# EAGLE design rare (EAGLE 9.6.2)
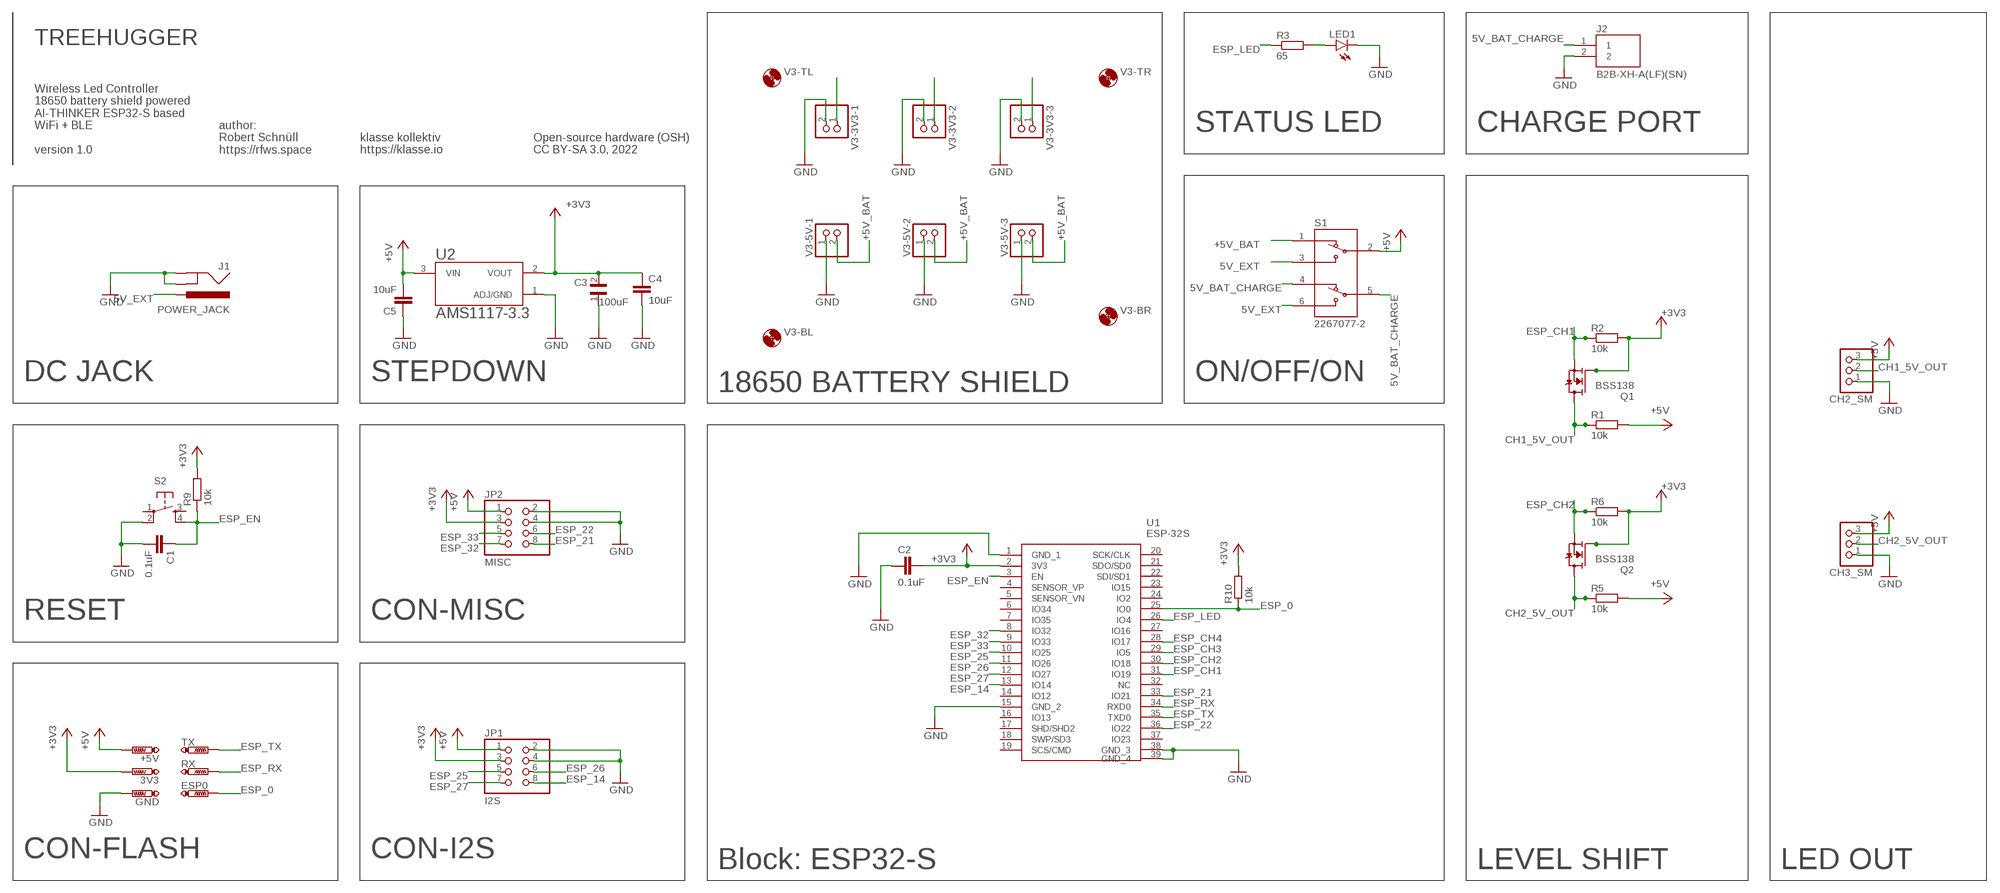
[diagram p0: schematic, sheet 1]

## Parts
3V3  PTR1TP15R  [TP15R]
+5V  PTR1TP15R  [TP15R]
C1  0.1uF  C-EUC0805  [C0805]
C2  0.1uF  C-EUC0805  [C0805]
C3  100uF  TAJB107K006RNJ  [CAPPC3528X210N]
C4  10uF  C-EUC0805  [C0805]
C5  10uF  C-EUC0805  [C0805]
CH2_SM  PINHD-1X3/90  [1X03/90]
CH3_SM  PINHD-1X3/90  [1X03/90]
ESP0  PTR1TP15R  [TP15R]
GND  PTR1TP15R  [TP15R]
J1  POWER_JACK  [POWER_JACK_PTH]
J2  B2B-XH-A(LF)(SN)  [JST_B2B-XH-A(LF)(SN)]
JP1  I2S  PINHD-2X4  [2X04]
JP2  MISC  PINHD-2X4  [2X04]
LED1  LEDCHIP-LED0805  [CHIP-LED0805]
Q1  BSS138  [SOT23]
Q2  BSS138  [SOT23]
R1  10k  R-EU_R0805  [R0805]
R2  10k  R-EU_R0805  [R0805]
R3  65  R-EU_R0805  [R0805]
R5  10k  R-EU_R0805  [R0805]
R6  10k  R-EU_R0805  [R0805]
R9  10k  R-EU_R0805  [R0805]
R10  10k  R-EU_R0805  [R0805]
RX  PTR1TP15R  [TP15R]
S1  2267077-2  [TE_2267077-2]
S2  TAC_SWITCHSMD  [TACTILE_SWITCH_SMD]
TX  PTR1TP15R  [TP15R]
U1  ESP-32S  [ESP-32S]
U2  AMS1117-3.3  [SOT229P700X180-4N]
V3-3V3-1  PINHD-1X2  [1X02]
V3-3V3-2  PINHD-1X2  [1X02]
V3-3V3-3  PINHD-1X2  [1X02]
V3-5V-1  PINHD-1X2  [1X02]
V3-5V-2  PINHD-1X2  [1X02]
V3-5V-3  PINHD-1X2  [1X02]
V3-BL  MOUNT-HOLE3.2  [3,2]
V3-BR  MOUNT-HOLE3.2  [3,2]
V3-TL  MOUNT-HOLE3.2  [3,2]
V3-TR  MOUNT-HOLE3.2  [3,2]

## Nets
5V_BAT_CHARGE: J2.1 S1.4 S1.5
5V_EXT: J1.PWR S1.3 S1.6
+3V3: 3V3.TP C2.2 C3.2 C4.1 JP1.3 JP2.3 Q1.1(G) Q2.1(G) R2.2 R6.2 R9.2 R10.2 U1.2(3V3) U2.2(VOUT)
+5V: +5V.TP C5.2 CH2_SM.3 CH3_SM.3 JP1.1 JP2.1 R1.2 R5.2 S1.2 U2.3(VIN)
+5V_BAT: S1.1 V3-5V-1.2 V3-5V-2.2 V3-5V-3.2
CH1_5V_OUT: CH2_SM.2 Q1.3(D) R1.1
CH2_5V_OUT: CH3_SM.2 Q2.3(D) R5.1
ESP_0: ESP0.TP R10.1 U1.25(IO0)
ESP_14: JP1.8 U1.13(IO14)
ESP_21: JP2.8 U1.33(IO21)
ESP_22: JP2.6 U1.36(IO22)
ESP_25: JP1.5 U1.10(IO25)
ESP_26: JP1.6 U1.11(IO26)
ESP_27: JP1.7 U1.12(IO27)
ESP_32: JP2.7 U1.8(IO32)
ESP_33: JP2.5 U1.9(IO33)
ESP_CH1: Q1.2(S) R2.1 U1.31(IO19)
ESP_CH2: Q2.2(S) R6.1 U1.30(IO18)
ESP_CH3: U1.29(IO5)
ESP_CH4: U1.28(IO17)
ESP_EN: C1.1 R9.1 S2.4 U1.3(EN)
ESP_LED: R3.1 U1.26(IO4)
ESP_RX: RX.TP U1.34(RXD0)
ESP_TX: TX.TP U1.35(TXD0)
GND: C1.2 C2.1 C3.1 C4.2 C5.1 CH2_SM.1 CH3_SM.1 GND.TP J1.GND J1.GNDBREAK J2.2 JP1.2 JP1.4 JP2.2 JP2.4 LED1.C S2.2 U1.1(GND_1) U1.15(GND_2) U1.38(GND_3) U1.39(GND_4) U2.1(ADJ/GND) V3-3V3-1.2 V3-3V3-2.2 V3-3V3-3.2 V3-5V-1.1 V3-5V-2.1 V3-5V-3.1
N$1: LED1.A R3.2
N$2: V3-3V3-1.1
N$4: V3-3V3-2.1
N$5: V3-3V3-3.1
Unconnected: S2.1 S2.3 U1.4(SENSOR_VP) U1.5(SENSOR_VN) U1.6(IO34) U1.7(IO35) U1.14(IO12) U1.16(IO13) U1.17(SHD/SHD2) U1.18(SWP/SD3) U1.19(SCS/CMD) U1.20(SCK/CLK) U1.21(SDO/SD0) U1.22(SDI/SD1) U1.23(IO15) U1.24(IO2) U1.27(IO16) U1.32(NC) U1.37(IO23)

## Notes on the sheet
- TREEHUGGER
- STATUS LED | CHARGE PORT
- Wireless Led Controller
  18650 battery shield powered
  AI-THINKER ESP32-S based
  WiFi + BLE
  
  version 1.0
- author:
  Robert Schnüll
  https://rfws.space
- klasse kollektiv
  https://klasse.io
- Open-source hardware (OSH)
  CC BY-SA 3.0, 2022
- DC JACK | STEPDOWN | ON/OFF/ON
- 18650 BATTERY SHIELD
- RESET | CON-MISC
- CON-FLASH | CON-I2S
- Block: ESP32-S | LEVEL SHIFT | LED OUT

## Library data of the parts
3V3 +5V ESP0 GND RX TX = testpad:PTR1: TEST PIN
C1 C2 C4 C5 = rcl:C-EU: CAPACITOR, European symbol; SPICEPREFIX: C
C3 = TAJB107K006RNJ:TAJB107K006RNJ: SMTT 100M B 006V K 125 Check availability <https://pricing.snapeda.com/parts/TAJB107K006RNJ/AVX/view-part?ref=eda>; AVAILABILITY: In Stock; DESCRIPTION: 100 µF Molded Tantalum Capacitors 6.3 V 1411 (3528 Metric), 1210 1.7Ohm; MF: AVX; MP: TAJB107K006RNJ; PACKAGE: 1210 AVX; PRICE: None; PURCHASE-URL: https://pricing.snapeda.com/search/part/TAJB107K006RNJ/?ref=eda
CH2_SM CH3_SM = pinhead:PINHD-1X3: PIN HEADER
J1 = SparkFun-Connectors:POWER_JACK: Power Jack Connector This is the standard 5.5mm barrel jack for power. The PTH is the most common, proven, reliable, footprint. The Slot footprint only works if the mill layer is transmitted to the PCB fab house so be warned. Here are the connectors we sell at SparkFun: DC Barrel Power Jack/Connector <https://www.sparkfun.com/products/119> (PRT-00119) DC Barrel Power Jack/Connector (SMD) <https://www.sparkfun.com/products/12748> (PRT-12748) DC Barrel Jack Adapter - Breadboard Compatible <https://www.sparkfun.com/products/10811> (PRT-10811) It is used on this SparkFun product (and many, many others): SparkFun RedBoard - Programmed with Arduino <https://www.sparkfun.com/products/12757> (DEV-12757) Also, if you need a mating power supply or connector, please check these out: Wall Adapter Power Supply - 9VDC 650mA <https://www.sparkfun.com/products/298> (TOL-00298) DC Barrel Jack Adapter - Male <https://www.sparkfun.com/products/10287> (PRT-10287); PROD_ID: CONN-08197
J2 = B2B-XH-A_LF__SN_:B2B-XH-A(LF)(SN): Connector Header Through Hole 2 position 0.098" (2.50mm) Check prices <https://pricing.snapeda.com/parts/B2B-XH-A%28LF%29%28SN%29/JST%20Sales/view-part?ref=eda> Check availability <https://pricing.snapeda.com/parts/B2B-XH-A%28LF%29%28SN%29/JST%20Sales%20America%20Inc./view-part?ref=eda>; AVAILABILITY: In Stock; DESCRIPTION: Connector Header Through Hole 2 position 0.098 (2.50mm); MF: JST Sales America Inc.; MP: B2B-XH-A(LF)(SN); PACKAGE: None; PRICE: None; PURCHASE-URL: https://pricing.snapeda.com/search/part/B2B-XH-A(LF)(SN)/?ref=eda
JP1 JP2 = pinhead:PINHD-2X4: PIN HEADER
LED1 = led:LED: LED OSRAM: - CHIPLED LG R971, LG N971, LY N971, LG Q971, LY Q971, LO R971, LY R971 LH N974, LH R974 LS Q976, LO Q976, LY Q976 LO Q996 - Hyper CHIPLED LW Q18S LB Q993, LB Q99A, LB R99A - SideLED LS A670, LO A670, LY A670, LG A670, LP A670 LB A673, LV A673, LT A673, LW A673 LH A674 LY A675 LS A676, LA A676, LO A676, LY A676, LW A676 LS A679, LY A679, LG A679 - Hyper Micro SIDELED® LS Y876, LA Y876, LO Y876, LY Y876 LT Y87S - SmartLED LW L88C, LW L88S LB L89C, LB L89S, LG L890 LS L89K, LO L89K, LY L89K LS L896, LA L896, LO L896, LY L896 - TOPLED LS T670, LO T670, LY T670, LG T670, LP T670 LSG T670, LSP T670, LSY T670, LOP T670, LYG T670 LG T671, LOG T671, LSG T671 LB T673, LV T673, LT T673, LW T673 LH T674 LS T676, LA T676, LO T676, LY T676, LB T676, LH T676, LSB T676, LW T676 LB T67C, LV T67C, LT T67C, LS T67K, LO T67K, LY T67K, LW E67C LS E67B, LA E67B, LO E67B, LY E67B, LB E67C, LV E67C, LT E67C LW T67C LS T679, LY T679, LG T679 LS T770, LO T770, LY T770, LG T770, LP T770 LB T773, LV T773, LT T773, LW T773 LH T774 LS E675, LA E675, LY E675, LS T675 LS T776, LA T776, LO T776, LY T776, LB T776 LHGB T686 LT T68C, LB T68C - Hyper Mini TOPLED® LB M676 - Mini TOPLED Santana® LG M470 LS M47K, LO M47K, LY M47K Source: http://www.osram.convergy.de LUXEON: - LUMILED® LXK2-PW12-R00, LXK2-PW12-S00, LXK2-PW14-U00, LXK2-PW14-V00 LXK2-PM12-R00, LXK2-PM12-S00, LXK2-PM14-U00 LXK2-PE12-Q00, LXK2-PE12-R00, LXK2-PE12-S00, LXK2-PE14-T00, LXK2-PE14-U00 LXK2-PB12-K00, LXK2-PB12-L00, LXK2-PB12-M00, LXK2-PB14-N00, LXK2-PB14-P00, LXK2-PB14-Q00 LXK2-PR12-L00, LXK2-PR12-M00, LXK2-PR14-Q00, LXK2-PR14-R00 LXK2-PD12-Q00, LXK2-PD12-R00, LXK2-PD12-S00 LXK2-PH12-R00, LXK2-PH12-S00 LXK2-PL12-P00, LXK2-PL12-Q00, LXK2-PL12-R00 Source: www.luxeon.com KINGBRIGHT: KA-3528ASYC Source: www.kingbright.com
Q1 Q2 = bss138_10:BSS138: BSS138 N-Channel Logic Level Enhancement Mode Field Effect Transistor Source: http://www.fairchildsemi.com/datasheets/BS/BSS138.pdf; MF: Fairchild; MPN: BSS138; OC_FARNELL: 9845330; OC_NEWARK: 67R2009
R1 R2 R5 R6 = resistor:R-EU_: RESISTOR, European symbol
R3 R9 R10 = rcl:R-EU_: RESISTOR, European symbol; SPICEPREFIX: R
S1 = 2267077-2:2267077-2: Switch Toggle ON ON DPDT Long Baton Lever PC Pins 20VAC 20VDC 0.4VA PC Mount with Threads Buy Part <https://snapeda.com/parts/2267077-2/TE%20Connectivity/view-part/?ref=eda>; AVAILABILITY: Bad; COMMENT: 2267077-2; DESCRIPTION: Switch Toggle ON ON DPDT Long Baton Lever PC Pins 20VAC 20VDC 0.4VA PC Mount with Threads; EU_ROHS_COMPLIANCE: Compliant with Exemptions; MF: TE Connectivity; MP: 2267077-2; PACKAGE: TO-94 TE Connectivity; PRICE: None
S2 = SparkFun:TAC_SWITCH: Momentary Switch Button commonly used for reset or general input. Spark Fun Electronics SKU : COM-00097
U1 = ESP-32s:ESP-32S: WiFi-BT-BLE MCU module Source: Datasheet; DESCRIPTION: WiFi-BT-BLE MCU module; HEIGHT: mm; MANUFACTURER_NAME: Ai-Thinker; MANUFACTURER_PART_NUMBER: ESP-32s
U2 = AMS1117-3.3:AMS1117-3.3: Sot223/Pkg 1-Amp 3.3-Volt Low Drop Out Voltage Regulatator; AVAILABILITY: Unavailable; DESCRIPTION: Sot223/Pkg 1-Amp 3.3-Volt Low Drop Out Voltage Regulatator; MF: Advanced Monolithic Systems; MP: AMS1117-3.3; PACKAGE: None; PRICE: None
V3-3V3-1-V3-3V3-3 V3-5V-1-V3-5V-3 = pinhead:PINHD-1X2: PIN HEADER
V3-BL V3-BR V3-TL V3-TR = _holes:MOUNT-HOLE: MOUNTING HOLE with drill center marker

## Board
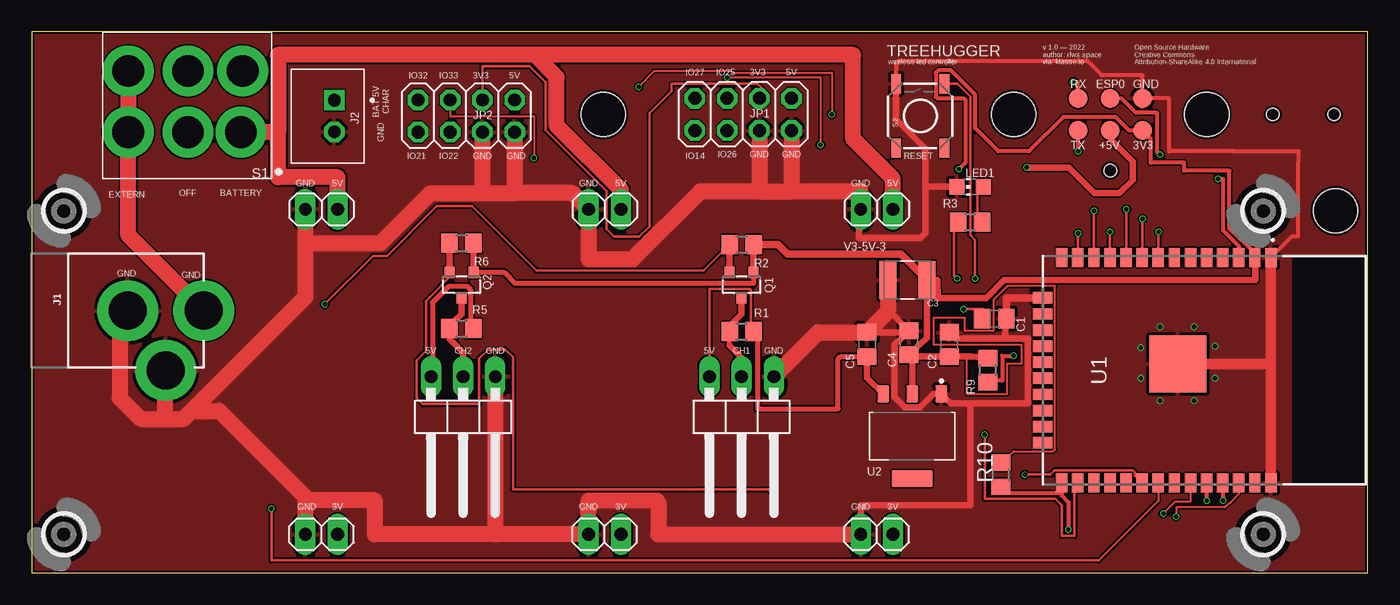
[diagram p1: board, top side]
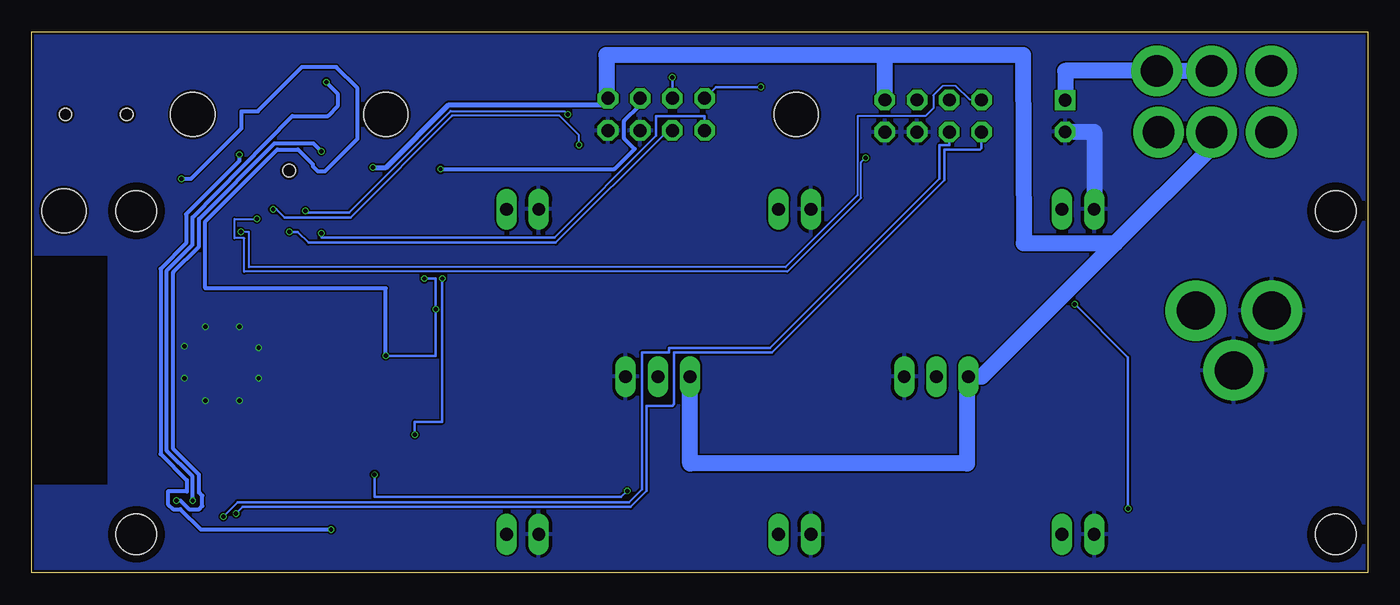
[diagram p2: board, bottom side, seen from below]

Size 105.41 x 42.72 mm. Coordinates in mm from the lower left corner, seen from the top.
Outline: 0,0 105.41,0 105.41,42.72 0,42.72 0,0
Copper layers (1*16): Top 0.035mm / dielectric 1.6mm / Bottom 0.035mm
Design rules "jlcpcb-2layers *": minimum track width 5mil, minimum drill 0.3mm, track to track 5mil, track to pad 5mil, pad to pad 5mil, via to via 5mil, smd to smd 5mil, copper to edge 0.2mm, drill to drill 6mil, minimum pad ring 10mil, minimum via ring 3mil, stop-mask expansion 4mil, vias tented up to drill 0mil, thermal gap 10mil
Holes 1 mm at 85.09,31.75 97.92,36.2 102.74,36.2
Holes 3.5 mm at 77.47,36.2 92.71,36.2 102.87,28.57 45.09,36.2
tRestrict: area 99.4,7 to 105.4,25
bRestrict: area 99.4,7 to 105.4,25
vRestrict: area 99.4,7 to 105.4,25

### Footprints (pad centres in the part's own frame; a part is rotated, then mirrored left to right if it is on the bottom)
TP15R = smd 1.5 x 1.5: TP 0,0
C0805 = smd 1.3 x 1.5: 1 -0.95,0; 2 0.95,0
CAPPC3528X210N = smd 1.34 x 3.02: 1 -1.54,0; 2 1.54,0
1X03/90 = drill 1.016 long: 1 -2.54,-3.81; 2 0,-3.81; 3 2.54,-3.81
POWER_JACK_PTH = drill 2.997 pad 4.318: GND 0,7.7; GNDBREAK 4.7,10.7; PWR 0,13.7
JST_B2B-XH-A(LF)(SN) = drill 1 square: 1 1.25,0 | drill 1 octagon: 2 -1.25,0
2X04 = drill 1.016 octagon: 1 -3.81,-1.27; 2 -3.81,1.27; 3 -1.27,-1.27; 4 -1.27,1.27; 5 1.27,-1.27; 6 1.27,1.27; 7 3.81,-1.27; 8 3.81,1.27
CHIP-LED0805 = smd 1.2 x 1.2: A 0,-1.05; C 0,1.05
SOT23 = smd 0.8 x 0.9: 1 -0.95,-1; 2 0.95,-1; 3 0,1
R0805 = smd 1.3 x 1.5: 1 -0.95,0; 2 0.95,0
TE_2267077-2 = drill 2.5: 1 -2.032,3.302; 2 2.159,3.302; 3 6.858,3.302; 4 -2.159,-1.524; 5 2.159,-1.524; 6 6.858,-1.524
TACTILE_SWITCH_SMD = smd 1.524 x 0.762: 1 -2.54,1.905; 2 2.54,1.905; 3 -2.54,-1.905; 4 2.54,-1.905
ESP-32S = smd 1.5 x 0.9: 1 -8.9,18.01; 2 -8.9,16.74; 3 -8.9,15.47; 4 -8.9,14.2; 5 -8.9,12.93; 6 -8.9,11.66; 7 -8.9,10.39; 8 -8.9,9.12; 9 -8.9,7.85; 10 -8.9,6.58; 11 -8.9,5.31; 12 -8.9,4.04; 13 -8.9,2.77; 14 -8.9,1.5; 25 8.9,1.5; 26 8.9,2.77; 27 8.9,4.04; 28 8.9,5.31; 29 8.9,6.58; 30 8.9,7.85; 31 8.9,9.12; 32 8.9,10.39; 33 8.9,11.66; 34 8.9,12.93; 35 8.9,14.2; 36 8.9,15.47; 37 8.9,16.74; 38 8.9,18.01 | smd 0.9 x 1.5: 15 -5.71,0; 16 -4.44,0; 17 -3.17,0; 18 -1.9,0; 19 -0.63,0; 20 0.64,0; 21 1.91,0; 22 3.18,0; 23 4.45,0; 24 5.72,0 | smd 4.5 x 4.5: 39 -0.508,10.668
SOT229P700X180-4N = smd 0.93 x 1.31: 1 -2.29,-3.345; 2 0,-3.345; 3 2.29,-3.345 | smd 3.24 x 1.31: 4 0,3.345
1X02 = drill 1.016 long: 1 -1.27,0; 2 1.27,0
3,2 = hole 3.2: 0,0

### Placement (x,y rotation side)
3V3  87.63,34.92 0 top
+5V  85.09,34.92 0 top
C1  75.95,20.07 0 top
C2  72.39,18.03 270 top
C3  69.09,23.11 0 top
C4  69.22,18.16 90 top
C5  65.91,18.03 270 top
CH2_SM  56.01,11.68 180 top
CH3_SM  34.04,11.68 180 top
ESP0  85.09,37.47 0 top
GND  87.63,37.47 0 top
J1  -0.13,20.7 270 top
J2  23.88,36.07 90 top
JP1  56.13,36.2 180 top
JP2  34.29,36.07 180 top
LED1  74.04,30.48 90 top
Q1  56.01,22.73 180 top
Q2  33.91,22.73 180 top
R1  56.01,19.05 0 top
R2  56.01,25.91 0 top
R3  74.04,27.69 0 top
R5  33.91,19.3 0 top
R6  33.91,26.04 0 top
R9  75.44,16 90 top
R10  76.45,7.75 90 top
RX  82.55,37.47 0 top
S1  14.48,38.1 180 top
S2  70.1,36.07 90 top
TX  82.55,34.92 0 top
U1  79.76,16 270 top
U2  69.47,10.79 180 top
V3-3V3-1  22.86,3.05 180 top
V3-3V3-2  45.21,3.05 180 top
V3-3V3-3  66.67,3.05 180 top
V3-5V-1  22.86,28.7 0 top
V3-5V-2  45.21,28.7 0 top
V3-5V-3  66.67,28.7 0 top
V3-BL  2.54,3.05 0 top
V3-BR  97.16,3.05 0 top
V3-TL  2.54,28.57 0 top
V3-TR  97.16,28.57 0 top

### Tracks (layer width: path | path; a pad name or v marks a point on that pad's centre or on a via)
5V_BAT_CHARGE
  Bottom 1.27: J2.1 23.88,39.62 S1.4 S1.5
5V_EXT
  Top 1.27: J1.PWR 7.62,26.65 S1.3 S1.6
+3V3  (via drill 0.35)
  Top 0.152: R10.2 77.48,9.6 80.6,9.6 80.73,9.74 80.73,22.64 76.98,22.64 75.89,21.55 75.89,19.11 75.87,19.08 73.63,19.08 73.63,20.12 71.16,20.12 71.16,18.03 78.08,18.03 78.08,16.53 78.06,16.51 76.96,16.51 76.96,14.12 73.79,14.12 73.79,17.08
  Top 0.2: JP2.3 35.56,40 39.28,40 40.54,38.75 40.54,34.95 45.34,30.14 45.34,27.14 45.94,26.55 47.92,26.55 48.72,27.35 48.72,36.28 50.49,38.05 50.49,38.61 57.28,38.61 57.53,38.35 57.53,37.59 JP1.3
  Top 0.305: v73.15,31.88 73.66,32.38 73.66,37.34 73.53,37.47 71.47,37.47 71.32,37.59 71.32,39.5 71.5,39.67 72.52,39.67 74.45,37.74 74.45,35.09 76.26,33.28 78.68,33.28 81.38,35.98 85.53,35.98 86.58,34.92 3V3.TP 88.27,34.29 88.27,32.38 90.93,32.38 90.93,31.75 94.49,31.75 94.49,27.18 96.5,25.3 U1.2
  Top 0.406: Q2.1 37.26,23.73 38.13,22.86 56.96,22.86 Q1.1
  Top 0.508: Q2.1 R6.2 | Q1.1 R2.2 | C4.1 69.47,16.96 U2.2 | C4.1 69.34,17.08 C2.2 73.79,17.08 74.15,17.08 R9.2 | C4.1 70.06,18.05 70.13,18.05 70.63,18.55 C3.2 71.47,23.11 71.51,21.72 75.31,21.72 76.71,23.11 96.52,23.11 96.52,24.88 U1.2
  Top 0.61: R2.2 58.88,25.91 59.62,25.17 68.57,25.17 C3.2
  Bottom 0.305: v73.15,31.88 59.44,31.88 57.85,33.47 58.67,34.29 58.66,35.68 57.4,36.94 JP1.3
+5V  (via drill 0.35)
  Top 0.203: 56.76,19.24 56.76,22.33 56.68,22.41 53.47,22.41 CH2_SM.3
  Top 0.406: R5.2 34.66,19.5 34.66,22.33 34.39,22.61 32.89,22.61 31.62,21.34 31.62,15.62 CH3_SM.3 | 56.76,19.24 R1.2 57.28,18.73 57.28,12.95 63.63,12.95 63.63,16.89 63.82,17.08 C5.2
  Top 0.508: U2.3 65.91,15.41 C5.2 | v78.49,32 81.82,32 83.84,29.98 85.82,29.98 86.86,31.02 86.86,32.48 85.22,34.13 85.22,34.8 +5V.TP
  Bottom 0.406: JP1.1 60.45,36.96 72.51,36.96 77.46,32 v78.49,32
  Bottom 1.27: 19.91,26.04 30.45,15.49 CH3_SM.3 31.62,15.37 31.62,8.64 53.47,8.64 CH2_SM.3 | JP2.1 38.1,40.87 | 19.91,26.04 27.14,26.04 27.2,40.87 38.1,40.87 | 38.1,40.87 60.07,40.87 60.07,37.59 JP1.1 | S1.2 12.32,33.62 19.91,26.04
+5V_BAT
  Top 1.27: V3-5V-1.2 24.13,31.24 19.44,31.24 19.44,34.8 | V3-5V-2.2 46.48,30.26 41.43,35.31 41.43,39.12 39.66,40.89 | 39.66,40.89 19.44,40.89 19.44,34.8 | 19.44,34.8 S1.1 | V3-5V-3.2 67.94,31.11 64.8,34.27 64.8,40.89 39.66,40.89
CH1_5V_OUT
  Top 0.406: 55.06,17.97 R1.1
  Top 0.508: R1.1 55.06,19.5 56.01,20.45 Q1.3 | CH2_SM.2 56.01,17.02 55.06,17.97
CH2_5V_OUT
  Top 0.406: 32.96,18.48 R5.1
  Top 0.508: R5.1 33.34,19.68 33.34,19.88 33.91,20.45 Q2.3 | CH3_SM.2 34.04,17.4 32.96,18.48
ESP_0  (via drill 0.35)
  Top 0.305: ESP0.TP 85.98,37.47 87.12,36.32 88.77,36.32 88.77,33.27 v89.03,33.02 | v81.79,3.43 81.79,5.59 81.26,6.12 U1.25 81.26,6.29 76.45,6.29 R10.1
  Bottom 0.305: v81.79,3.43 92.08,3.43 93.68,5.03 94.26,5.03 94.66,5.43 94.66,6.43 93.17,6.43 93.17,7.32 95.25,9.4 95.25,24 93.22,26.03 93.22,28.32 89.03,32.51 v89.03,33.02
ESP_14  (via drill 0.35)
  Top 0.2: U1.13 82.53,26.77 v82.55,26.8
  Bottom 0.2: v82.55,26.8 82.55,26.47 64.17,26.47 56.14,34.51 56.14,36.07 52.32,36.07 JP1.8
ESP_21  (via drill 0.35)
  Top 0.152: U1.33 91.42,5.62 90.2,5.62 v89.28,4.7
  Bottom 0.2: v89.28,4.7 88.77,5.21 58.17,5.21 56.9,6.47 56.9,13.2 54.87,13.2 54.74,13.34 54.73,14.82 54.73,17.4 46.99,17.4 33.4,30.99 33.4,33.4 30.61,33.4 30.48,33.53 JP2.8
ESP_22  (via drill 0.35)
  Top 0.152: U1.36 95.23,6.23 94.58,5.59 94.14,5.17 90.3,5.17 v90.3,4.45
  Bottom 0.2: JP2.6 33.02,33.78 33.78,33.78 33.78,31.11 47.15,17.75 55.12,17.75 55.12,17.4 57.27,17.4 57.27,6.61 58.3,5.58 89.16,5.58 v90.3,4.45
ESP_25  (via drill 0.35)
  Top 0.152: v54.86,39.12 62.23,39.12 v62.23,33.78
  Top 0.2: v86.36,28.7 86.36,24.93 U1.10
  Bottom 0.152: v62.23,33.78 62.23,34.54 63.82,36.13 72.26,36.13 72.22,36.1
  Bottom 0.2: JP1.5 v54.86,39.12 | 72.22,36.1 80.26,28.07 85.47,28.07 86.11,28.7 v86.36,28.7
ESP_26  (via drill 0.35)
  Top 0.2: U1.11 85.07,26.9 v85.09,26.92
  Bottom 0.2: JP1.6 55.22,34.92 64.08,26.06 83.58,26.06 84.44,26.92 v85.09,26.92
ESP_27  (via drill 0.35)
  Top 0.152: v47.88,38.35 49.15,39.62 55.12,39.62 55.24,39.5 63.12,39.5 v63.12,36.2
  Top 0.2: U1.12 83.8,28.55 v83.82,28.57
  Bottom 0.152: 72.37,36.45 63.37,36.45 v63.12,36.2
  Bottom 0.2: JP1.7 51.44,38.35 v47.88,38.35 | 72.37,36.45 80.37,28.45 83.7,28.45 v83.82,28.57
ESP_32  (via drill 0.35)
  Top 0.2: v88.9,26.92 88.9,24.93 U1.8
  Bottom 0.127: 34.29,37.7 33.5,38.48 32.54,38.48 31.39,37.34 JP2.7
  Bottom 0.152: 34.29,37.7 34.29,36.67 34.89,36.07 40.26,36.07 40.26,29.81 45.94,24.13 88.27,24.13 88.27,26.92 v88.9,26.92
ESP_33  (via drill 0.35)
  Top 0.152: JP2.5 33.02,36.07 39.62,36.07 v39.62,32.77
  Top 0.2: U1.9 87.61,27.92 v87.63,27.94
  Bottom 0.152: 88.64,23.78 45.79,23.78 39.98,29.59 39.98,32.41 v39.62,32.77 | 88.65,23.77 88.65,26.42 89.41,26.42 89.4,27.94 v87.63,27.94
  Bottom 0.2: 88.64,23.78 88.65,23.77 | v87.63,27.94
ESP_CH1  (via drill 0.35)
  Top 0.152: U1.31 88.88,5.69
  Top 0.2: 88.88,5.69 84.17,0.99 18.92,0.99 v18.92,5.08 | R2.1 53,23.85 39.81,23.85 34.73,28.94 31.95,28.94
  Top 0.203: 31.95,28.94 28.03,25.02 26.92,25.02 v23.11,21.21
  Top 0.508: Q1.2 R2.1
  Bottom 0.2: v23.11,21.21 18.92,17.02 v18.92,5.08
ESP_CH2  (via drill 0.35)
  Top 0.2: U1.30 87.04,7.67 87.04,7.96 86.89,8.1 80.7,8.1 80.37,7.78
  Top 0.203: v58.42,6.48 58.29,6.6 37.96,6.6 37.96,17.03 37.34,17.65 36.03,17.65 35.31,16.93 35.31,13.34 30.82,13.34 30.35,13.8 30.35,16.76 31.11,17.53 31.11,21.46 31.43,21.78 32.96,23.34 Q2.2 | v78.36,7.75 78.39,7.78 80.37,7.78
  Top 0.508: Q2.2 R6.1
  Bottom 0.203: v78.36,7.75 78.36,6 58.9,6 v58.42,6.48
ESP_EN  (via drill 0.35)
  Top 0.2: v73.53,20.83 75.07,20.83 C1.1 | S2.4 73.03,38.61 74.04,37.59 74.04,26.67 74.42,26.29 v74.42,23.24
  Top 0.305: R9.1 75.56,15.18 76.58,15.18 76.58,17.14 v77.47,17.14 | v93.6,31.11 93.98,31.11 93.98,27.05 95.23,25.8 U1.3
  Bottom 0.2: v74.42,23.24 73.53,23.24 v73.53,20.83 73.53,17.14 v77.47,17.14
  Bottom 0.305: v93.6,31.11 92.84,31.11 88.86,35.09 88.86,36.45 87.58,36.45 84.1,39.93 81.38,39.93 79.71,38.26 79.71,34.26 82.27,31.7 82.83,31.7 83.23,32.1 83.23,32.25 84.4,33.42 86.03,33.42 91.71,27.74 91.71,22.48 77.47,22.48 v77.47,17.14
ESP_LED  (via drill 0.35)
  Top 0.2: U1.26 82.27,6.85 82.27,2.92 81.28,2.92 81.28,5.33 81.15,5.46 80.77,5.84 75.18,5.84 v75.18,10.92 | R3.1 72.77,27.37 72.77,23.5 v73.03,23.24
  Bottom 0.2: v75.18,10.92 75.18,11.94 73.03,11.94 v73.03,23.24
ESP_RX  (via drill 0.35)
  Top 0.305: U1.34 92.69,5.74 v92.71,5.71 | v82.17,38.73 82.55,38.73 RX.TP
  Bottom 0.305: v92.71,5.71 92.71,7.62 94.74,9.65 94.74,23.88 92.71,25.91 92.71,28.07 84.85,36.07 82.04,36.07 81.28,36.83 81.28,37.85 v82.17,38.73
ESP_TX  (via drill 0.35)
  Top 0.305: U1.35 93.96,5.74 v93.98,5.71 | TX.TP v82.55,33.27
  Bottom 0.305: v93.98,5.71 93.68,5.71 92.99,5.03 92.21,5.03 91.95,5.29 91.95,6.1 92.2,6.35 92.2,7.75 94.23,9.78 94.23,23.75 92.2,25.78 92.21,27.95 86.24,33.92 83.19,33.92 v82.55,33.27
GND  (via drill 0.35)
  Top 0.305: U1.1 99.42,26.55 99.92,26.55 99.92,31.65 99.98,33.27 94.87,33.27 94.87,33.28 89.74,33.28 89.74,37.47 GND.TP 87.63,39.28 84.42,39.28 83.31,40.39 68.33,40.39 68.2,40.26 S2.2
  Top 0.508: C4.2 68.37,18.27 68.3,18.27 68.06,18.03 68.06,13.9 68.88,13.08 70.06,13.08 71.12,14.14 U2.1 72.5,13.39 74.04,13.39 | C4.2 69.09,18.98 C5.1 | C4.2 67.55,20.78 C3.1 | 74.04,13.39 78.59,13.39 78.59,18.51 77.06,18.51 | 77.06,18.51 76.79,18.78 C1.2 | 77.06,18.51 72.86,18.51 C2.1 | 74.04,13.39 74.04,5.33 65.41,5.33 V3-3V3-3.2 | LED1.C 70.51,30.48 | 70.51,30.48 70.51,26.82 70.1,26.42 65.28,26.42 65.28,28.57 V3-5V-3.1 | 70.51,30.48 70.51,33.5 68.2,35.81 S2.2
  Top 0.61: U1.15 76.9,21.71 C1.2
  Top 0.813: U1.1 97.77,16.51 | 97.77,16.51 U1.38 | U1.39 97.77,16.51
  Top 1.27: CH3_SM.1 36.58,3.05 | 10.54,12.17 8.59,12.17 6.94,13.82 6.94,20.07 J1.GND | 10.54,12.17 12,12.17 12.63,12.8 | 12.63,12.8 14.79,12.8 21.59,6 21.59,5.33 | 36.58,3.05 V3-3V3-2.2 43.94,5.71 49.28,5.71 49.44,5.56 49.44,3.05 V3-3V3-3.2 | 36.58,3.05 27.08,3.05 27.08,5.71 21.97,5.71 21.59,5.33 | 21.59,5.33 V3-3V3-1.2 | V3-5V-1.1 21.59,26.04 | 21.59,26.04 27.52,26.04 31.46,29.97 35.56,29.97 | V3-5V-3.1 65.41,30.11 59.94,30.11 | 57.4,30.11 52.75,30.11 47.4,24.77 43.94,24.77 V3-5V-2.1 42.67,29.97 38.1,29.97 | JP1.2 59.94,30.11 | JP1.4 57.4,30.11 | CH2_SM.1 62.04,18.98 C5.1 67.55,20.62 C3.1 | 57.4,30.11 59.94,30.11 | 35.56,29.97 JP2.4 | 35.56,29.97 38.1,29.97 | JP2.2 38.1,29.97 | 21.59,26.04 21.59,21.76 12.63,12.8 | 10.54,12.17 10.54,15.97 J1.GNDBREAK
  Bottom 1.27: J2.2 21.59,34.82 V3-5V-1.1
  other vias: 91.69,19.43 89.03,19.43 89.03,13.59 91.69,13.59 87.5,17.78 87.5,15.37 93.34,15.37 93.34,17.91
  pour Bottom: -5.46,49.28 -3.94,50.8 109.6,50.8 109.6,-3.56 108.58,-4.57 -6.86,-4.57 -7.75,-5.46 -7.75,47.37 -5.71,49.4 -5.59,49.4
  pour Top: -6.1,52.32 111.51,52.32 112.78,51.05 112.78,-2.92 108.84,-6.86 -8,-6.86 -9.91,-4.95 -9.91,49.15 -8.51,50.55 -6.73,52.32
N$1
  Top 0.152: 74.61,30 LED1.A
  Top 0.2: 74.61,30 74.61,28.07 R3.2

### Text on the board
tPlace: TREEHUGGER | wireless led controller | v 1.0 — 2022 / author: rfws.space / via: klasse.io | Open Source Hardware / Creative Commons / Attribution-ShareAlike 4.0 International | IO32 | IO33 | 3V3 | 5V | IO27 | IO25 | 3V3 | 5V | BAT 5V / CHAR | GND | IO21 | IO22 | GND | GND | IO14 | IO26 | GND | GND | RESET | GND | 5V | GND | 5V | GND | 5V | EXTERN | OFF | BATTERY | GND | GND | 5V | CH2 | GND | 5V | CH1 | GND | GND | 3V | GND | 3V | GND | 3V